# Altium project ERA-51SM+.PrjPcb
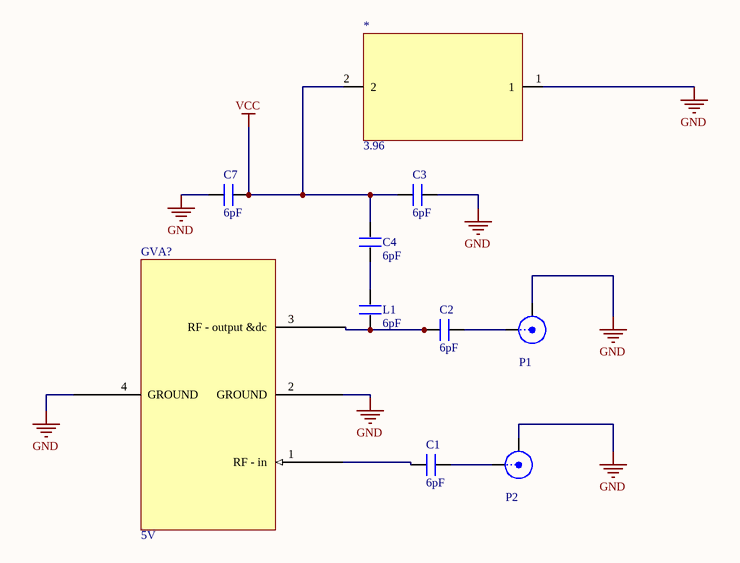
[diagram p0: ERA-51SM+.SchDoc]
1 sheet, 10 parts. Net scope: global (net labels, ports and power ports of the same name join across sheets).
Board file: ERA-51SM+.PcbDoc

## Sheet ERA-51SM+.SchDoc
size A4

### Parts
*  3.96  [3.96]
C1  6pF  [0402]
C2  6pF  [0402]
C3  6pF  [1206C]
C4  6pF  [0603C]
C7  6pF  [0603C]
ERA-51  5V  [WX107]
L1  6pF  [0402]
P1  SMA  [SMA]  (value not drawn)
P2  SMA  [SMA]  (value not drawn)

### Nets
GND: *.1 C3.2 C7.1 ERA-51.2(GROUND) ERA-51.4(GROUND) P1.2(Y) P2.2(Y)
VCC: *.2 C3.1 C4.2 C7.2
NetC1_1: C1.1 ERA-51.1(RF_-_in)
NetC1_2: C1.2 P2.1(X)
NetC2_1: C2.1 ERA-51.3(RF_-_output_&dc) L1.1
NetC2_2: C2.2 P1.1(X)
NetC4_1: C4.1 L1.2

### Library data of the parts
C1-C4 C7 L1 = C: Capacitor
ERA-51 = GVA-81+
P1 P2 = SMA: SMA Connector